# Altium project FLOM_Converter.PrjPcb
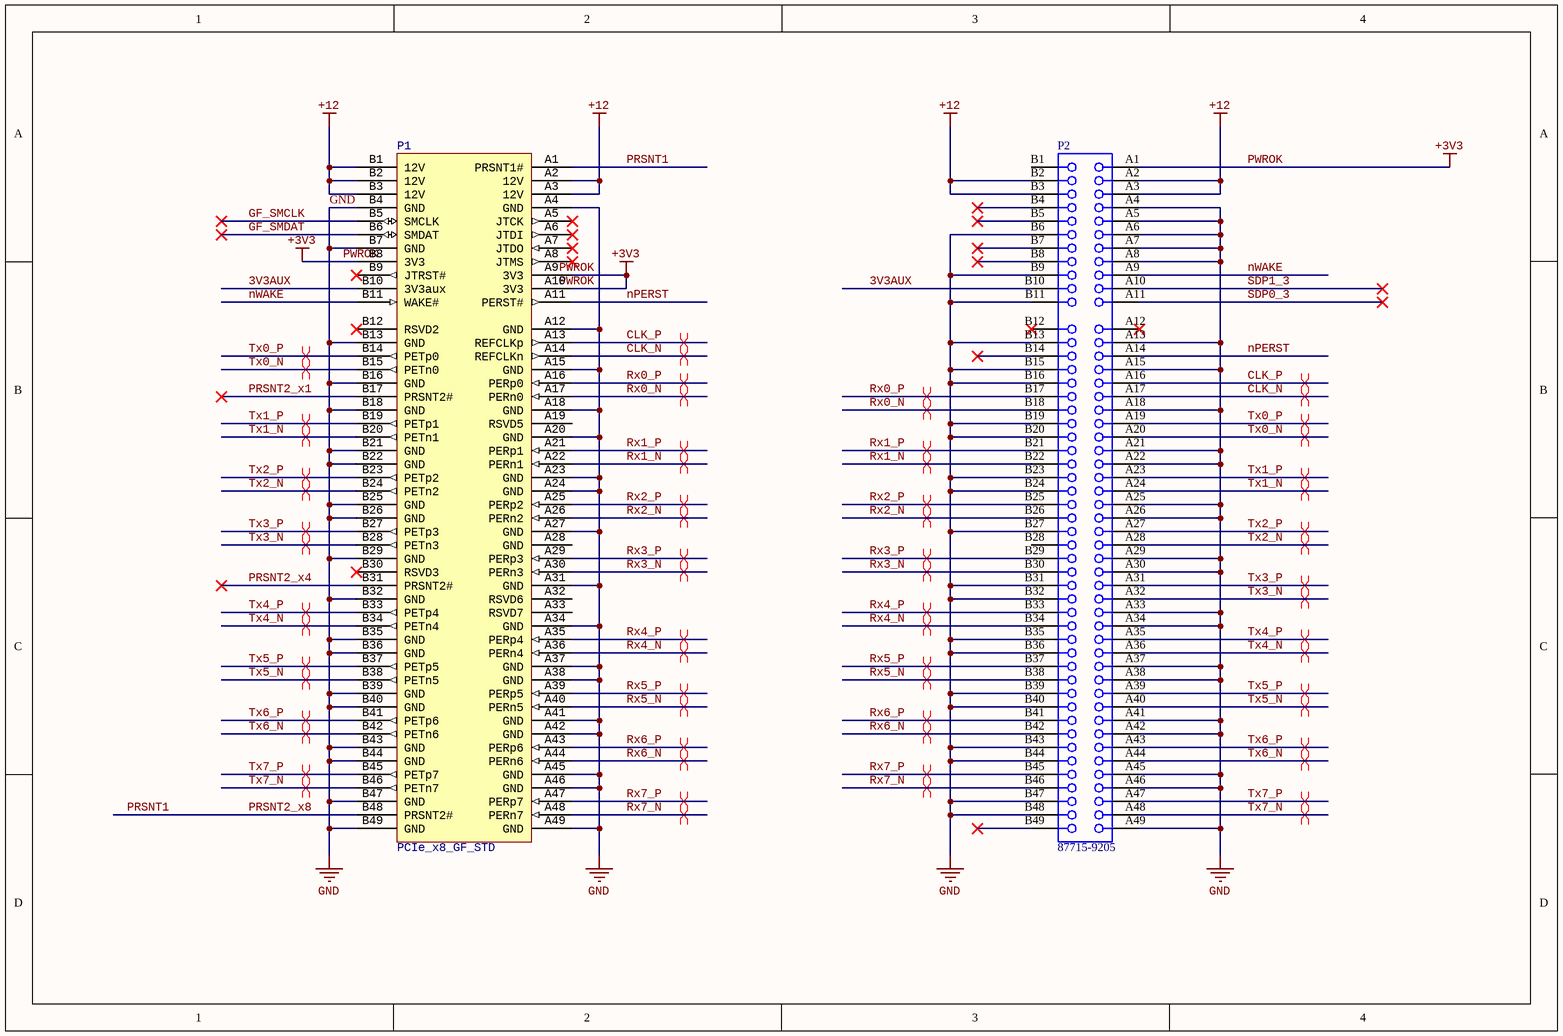
[diagram p0: FLOM_Converter.SchDoc]
1 sheet, 2 parts. Net scope: global (net labels, ports and power ports of the same name join across sheets).
Board file: FLOM_Converter.PcbDoc

## Sheet FLOM_Converter.SchDoc
size A4

### Parts
P1  PCIe_x8_GF_STD  [PCIe_x8_GF_STD]
P2  87715-9205  [BTB1-00-2V98]

### Nets
+12: P1.A2(12V) P1.A3(12V) P1.B1(12V) P1.B2(12V) P1.B3(12V) P2.A2 P2.A3 P2.B2 P2.B3
GND: P1.A4(GND) P1.A12(GND) P1.A15(GND) P1.A18(GND) P1.A20(GND) P1.A23(GND) P1.A24(GND) P1.A27(GND) P1.A31(GND) P1.A34(GND) P1.A37(GND) P1.A38(GND) P1.A41(GND) P1.A42(GND) P1.A45(GND) P1.A46(GND) P1.A49(GND) P1.B4(GND) P1.B7(GND) P1.B13(GND) P1.B16(GND) P1.B18(GND) P1.B21(GND) P1.B22(GND) P1.B25(GND) P1.B26(GND) P1.B29(GND) P1.B32(GND) P1.B35(GND) P1.B36(GND) P1.B39(GND) P1.B40(GND) P1.B43(GND) P1.B44(GND) P1.B47(GND) P1.B49(GND) P2.A4 P2.A5 P2.A6 P2.A7 P2.A8 P2.A13 P2.A15 P2.A18 P2.A21 P2.A22 P2.A25 P2.A26 P2.A29 P2.A30 P2.A33 P2.A34 P2.A37 P2.A38 P2.A41 P2.A42 P2.A45 P2.A46 P2.A49 P2.B6 P2.B9 P2.B11 P2.B13 P2.B15 P2.B16 P2.B19 P2.B20 P2.B23 P2.B24 P2.B27 P2.B31 P2.B32 P2.B35 P2.B36 P2.B39 P2.B40 P2.B43 P2.B44 P2.B47 P2.B48
PWROK: P1.A9(3V3) P1.A10(3V3) P1.B8(3V3) P2.A1  [also labelled +3V3]
3V3AUX: P1.B10(3V3aux) P2.B10
CLK_N: P1.A14(REFCLKn) P2.A17
CLK_P: P1.A13(REFCLKp) P2.A16
GF_SMCLK: P1.B5(SMCLK)
GF_SMDAT: P1.B6(SMDAT)
nPERST: P1.A11(PERST#) P2.A14
nWAKE: P1.B11(WAKE#) P2.A9
PRSNT1: P1.A1(PRSNT1#) P1.B48(PRSNT2#)  [also labelled PRSNT2_x8]
PRSNT2_x1: P1.B17(PRSNT2#)
PRSNT2_x4: P1.B31(PRSNT2#)
Rx0_N: P1.A17(PERn0) P2.B18
Rx0_P: P1.A16(PERp0) P2.B17
Rx1_N: P1.A22(PERn1) P2.B22
Rx1_P: P1.A21(PERp1) P2.B21
Rx2_N: P1.A26(PERn2) P2.B26
Rx2_P: P1.A25(PERp2) P2.B25
Rx3_N: P1.A30(PERn3) P2.B30
Rx3_P: P1.A29(PERp3) P2.B29
Rx4_N: P1.A36(PERn4) P2.B34
Rx4_P: P1.A35(PERp4) P2.B33
Rx5_N: P1.A40(PERn5) P2.B38
Rx5_P: P1.A39(PERp5) P2.B37
Rx6_N: P1.A44(PERn6) P2.B42
Rx6_P: P1.A43(PERp6) P2.B41
Rx7_N: P1.A48(PERn7) P2.B46
Rx7_P: P1.A47(PERp7) P2.B45
SDP0_3: P2.A11
SDP1_3: P2.A10
Tx0_N: P1.B15(PETn0) P2.A20
Tx0_P: P1.B14(PETp0) P2.A19
Tx1_N: P1.B20(PETn1) P2.A24
Tx1_P: P1.B19(PETp1) P2.A23
Tx2_N: P1.B24(PETn2) P2.A28
Tx2_P: P1.B23(PETp2) P2.A27
Tx3_N: P1.B28(PETn3) P2.A32
Tx3_P: P1.B27(PETp3) P2.A31
Tx4_N: P1.B34(PETn4) P2.A36
Tx4_P: P1.B33(PETp4) P2.A35
Tx5_N: P1.B38(PETn5) P2.A40
Tx5_P: P1.B37(PETp5) P2.A39
Tx6_N: P1.B42(PETn6) P2.A44
Tx6_P: P1.B41(PETp6) P2.A43
Tx7_N: P1.B46(PETn7) P2.A48
Tx7_P: P1.B45(PETp7) P2.A47

Not connected (* = marked no-connect by the designer): P1 A5(JTCK)* A6(JTDI)* A7(JTDO)* A8(JTMS)* A19(RSVD5) A28(GND) A32(RSVD6) A33(RSVD7) B9(JTRST#)* B12(RSVD2)* B30(RSVD3)*; P2 A12* B1 B4* B5* B7* B8* B12* B14* B28 B49*

### Layout directives
differential pair: CLK_N, CLK_P, Rx0_N, Rx0_P, Rx1_N, Rx1_P, Rx2_N, Rx2_P, Rx3_N, Rx3_P, Rx4_N, Rx4_P, Rx5_N, Rx5_P, Rx6_N, Rx6_P, Rx7_N, Rx7_P, Tx0_N, Tx0_P, Tx1_N, Tx1_P, Tx2_N, Tx2_P, Tx3_N, Tx3_P, Tx4_N, Tx4_P, Tx5_N, Tx5_P, Tx6_N, Tx6_P, Tx7_N, Tx7_P

### Notes on the sheet
- Labels drawn without touching a wire or pin: PWROK

### Library data of the parts
P2 = CMP-0001-00128-1: Board-to-Board Connector, PTH, Vertical, Pitch 1.00mm, 98-Position; Mating Connector: PCIeX8-GF-2D-1000-1K-O98; Datasheet Version: Jul-2007; ClassName: Board Template Connector; Component Kind: Standard; Publisher: Altium; Package Reference: BTB1-00-2V98